# Altium schematic sheet 外围电路.SchDoc
size A4
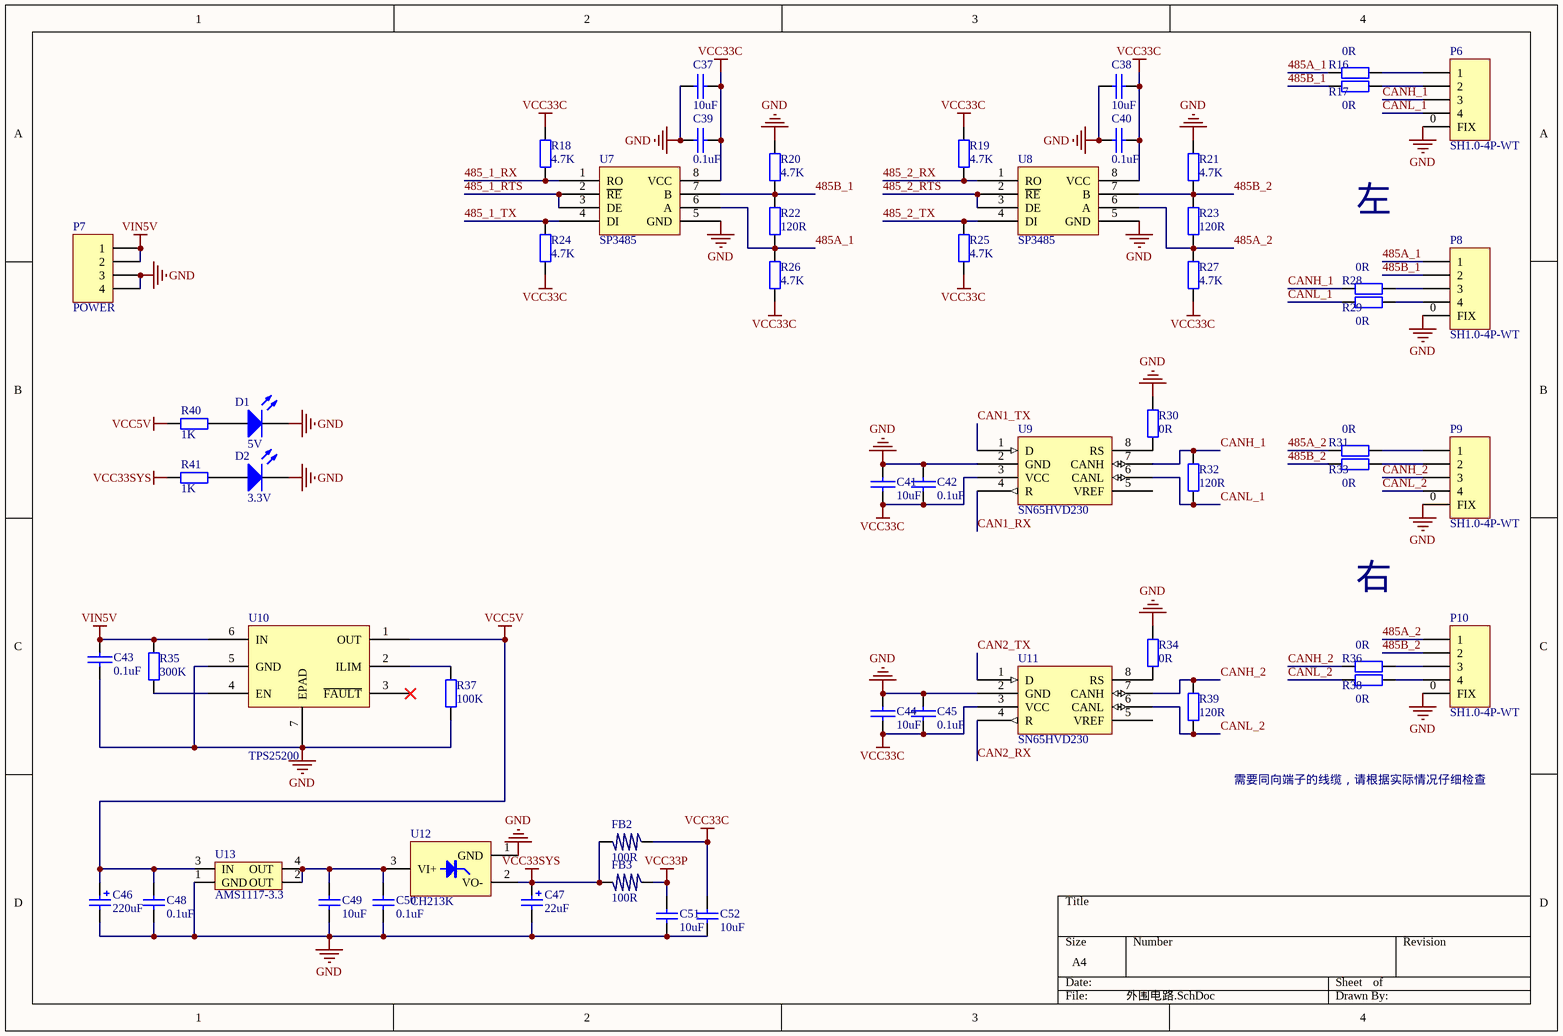
[diagram p0: 外围电路.SchDoc]

## Parts
C37  10uF  [C0805_M]
C38  10uF  [C0805_M]
C39  0.1uF  [C0805_M]
C40  0.1uF  [C0805_M]
C41  10uF  [C0805_M]
C42  0.1uF  [C0805_M]
C43  0.1uF  [C0805_M]
C44  10uF  [C0805_M]
C45  0.1uF  [C0805_M]
C46  220uF  [CS 6*6 - R]
C47  22uF  [CS 6*6 - R]
C48  0.1uF  [C0805_M]
C49  10uF  [C0805_M]
C50  0.1uF  [C0805_M]
C51  10uF  [C0805_M]
C52  10uF  [C0805_M]
D1  5V  [LED0805_G]
D2  3.3V  [LED0805_G]
FB2  100R  [R0805_M]
FB3  100R  [R0805_M]
P6  SH1.0-4P-WT  [SH1.0-LT-4P]
P7  POWER  [XH2.54-LI-4P]
P8  SH1.0-4P-WT  [SH1.0-LT-4P]
P9  SH1.0-4P-WT  [SH1.0-LT-4P]
P10  SH1.0-4P-WT  [SH1.0-LT-4P]
R16  0R  [R0805_M]
R17  0R  [R0805_M]
R18  4.7K  [R0805_M]
R19  4.7K  [R0805_M]
R20  4.7K  [R0805_M]
R21  4.7K  [R0805_M]
R22  120R  [R0805_M]
R23  120R  [R0805_M]
R24  4.7K  [R0805_M]
R25  4.7K  [R0805_M]
R26  4.7K  [R0805_M]
R27  4.7K  [R0805_M]
R28  0R  [R0805_M]
R29  0R  [R0805_M]
R30  0R  [R0805_M]
R31  0R  [R0805_M]
R32  120R  [R0805_M]
R33  0R  [R0805_M]
R34  0R  [R0805_M]
R35  300K  [R0805_M]
R36  0R  [R0805_M]
R37  100K  [R0805_M]
R38  0R  [R0805_M]
R39  120R  [R0805_M]
R40  1K  [R0805_M]
R41  1K  [R0805_M]
U7  SP3485  [SOIC-8]
U8  SP3485  [SOIC-8]
U9  SN65HVD230  [SOIC-8]
U10  TPS25200  [WSON-6]
U11  SN65HVD230  [SOIC-8]
U12  CH213K  [SOT-23-3]
U13  AMS1117-3.3  [SOT223_M]

## Nets
GND: C37.1 C38.1 C39.1 C40.1 C41.2 C42.2 C43.2 C44.2 C45.2 C46.2 C47.2 C48.1 C49.1 C50.1 C51.1 C52.1 D1.2(K) D2.2(K) P6.0(FIX) P7.3 P7.4 P8.0(FIX) P9.0(FIX) P10.0(FIX) R20.2 R21.2 R30.2 R34.2 R37.1 U7.5(GND) U8.5(GND) U9.2(GND) U10.5(GND) U10.7(EPAD) U11.2(GND) U12.1(GND) U13.1(GND)
VCC5V: C46.1 C48.2 R40.2 U10.1(OUT) U13.3(IN)
VCC33C: C37.2 C38.2 C39.2 C40.2 C41.1 C42.1 C44.1 C45.1 C52.2 FB2.1 R18.2 R19.2 R24.1 R25.1 R26.1 R27.1 U7.8(VCC) U8.8(VCC) U9.3(VCC) U11.3(VCC)
VCC33P: C51.2 FB3.1
VCC33SYS: C47.1 FB2.2 FB3.2 R41.2 U12.2(VO-)
VIN5V: C43.1 P7.1 P7.2 R35.2 U10.6(IN)
485_1_RTS: U7.2(~{RE}) U7.3(DE)
485_1_RX: R18.1 U7.1(RO)
485_1_TX: R24.2 U7.4(DI)
485_2_RTS: U8.2(~{RE}) U8.3(DE)
485_2_RX: R19.1 U8.1(RO)
485_2_TX: R25.2 U8.4(DI)
485A_1: P8.1 R16.2 R22.1 R26.2 U7.6(A)
485A_2: P10.1 R23.1 R27.2 R31.2 U8.6(A)
485B_1: P8.2 R17.2 R20.1 R22.2 U7.7(B)
485B_2: P10.2 R21.1 R23.2 R33.2 U8.7(B)
CAN1_RX: U9.4(R)
CAN1_TX: U9.1(D)
CAN2_RX: U11.4(R)
CAN2_TX: U11.1(D)
CANH_1: P6.3 R28.2 R32.2 U9.7(CANH)
CANH_2: P9.3 R36.2 R39.2 U11.7(CANH)
CANL_1: P6.4 R29.2 R32.1 U9.6(CANL)
CANL_2: P9.4 R38.2 R39.1 U11.6(CANL)
NetC49_2: C49.2 C50.2 U12.3(VI+) U13.2(OUT) U13.4(OUT)
NetD1_1: D1.1(A) R40.1
NetD2_1: D2.1(A) R41.1
NetP6_1: P6.1 R16.1
NetP6_2: P6.2 R17.1
NetP8_3: P8.3 R28.1
NetP8_4: P8.4 R29.1
NetP9_1: P9.1 R31.1
NetP9_2: P9.2 R33.1
NetP10_3: P10.3 R36.1
NetP10_4: P10.4 R38.1
NetR30_1: R30.1 U9.8(RS)
NetR34_1: R34.1 U11.8(RS)
NetR35_1: R35.1 U10.4(EN)
NetR37_2: R37.2 U10.2(ILIM)

Not connected (* = marked no-connect by the designer): U9 5(VREF); U10 3(~{FAULT})*; U11 5(VREF)

## Notes on the sheet
- 左
- 右
- 需要同向端子的线缆，请根据实际情况仔细检查

## Library data of the parts
C37-C45 = CAP: Capacitor
C46 C47 = Cap Pol2: Polarized Capacitor (Axial); Value: 100pF; Published: 8-Jun-2000; LatestRevisionDate: 17-Jul-2002; LatestRevisionNote: Re-released for DXP Platform.; PackageReference: POLAR0.8; Publisher: Altium Limited; PackageDescription: Polarized Capacitor; 2 Leads
C48-C52 = Cap: Capacitor; Value: 100pF; Published: 8-Jun-2000; LatestRevisionDate: 17-Jul-2002; LatestRevisionNote: Re-released for DXP Platform.; PackageReference: RAD-0.3; Publisher: Altium Limited; PackageDescription: Radial Cap, Thru-Hole; 2 Leads; 0.3 in Pin Spacing
D1 D2 = LED1: Typical RED GaAs LED; Published: 8-Jun-2000; LatestRevisionDate: 08-Jul-2005; LatestRevisionNote: Mech Layer 1 removed.; PackageReference: LED-1; Publisher: Altium Limited; PackageDescription: LED; 2 Leads
FB2 FB3 = L
P6 P8-P10 = Header 5: Header, 5-Pin; LatestRevisionDate: 17-Jul-2002; LatestRevisionNote: Re-released for DXP Platform.; Publisher: Altium Limited
P7 = Header 4: Header, 4-Pin; LatestRevisionDate: 17-Jul-2002; LatestRevisionNote: Re-released for DXP Platform.; Publisher: Altium Limited
R16-R39 = Res2: Resistor; Value: 1K; Published: 8-Jun-2000; LatestRevisionDate: 17-Jul-2002; LatestRevisionNote: Re-released for DXP Platform.; PackageReference: AXIAL-0.4; Publisher: Altium Limited; PackageDescription: Axial Device, Thru-Hole; 2 Leads; 0.4 in Pin Spacing
R40 R41 = Res2: Resistor; Published: 8-Jun-2000; LatestRevisionDate: 17-Jul-2002; LatestRevisionNote: Re-released for DXP Platform.; PackageReference: AXIAL-0.4; Publisher: Altium Limited; PackageDescription: Axial Device, Thru-Hole; 2 Leads; 0.4 in Pin Spacing; Value: 1K
U9 U11 = SN65HVD230/1
U12 = CH213K: Ideal Diode 5V*1A
U13 = AMS1117